# Altium schematic sheet main.SchDoc
size B; SheetNumber: 1; SheetTotal: 1
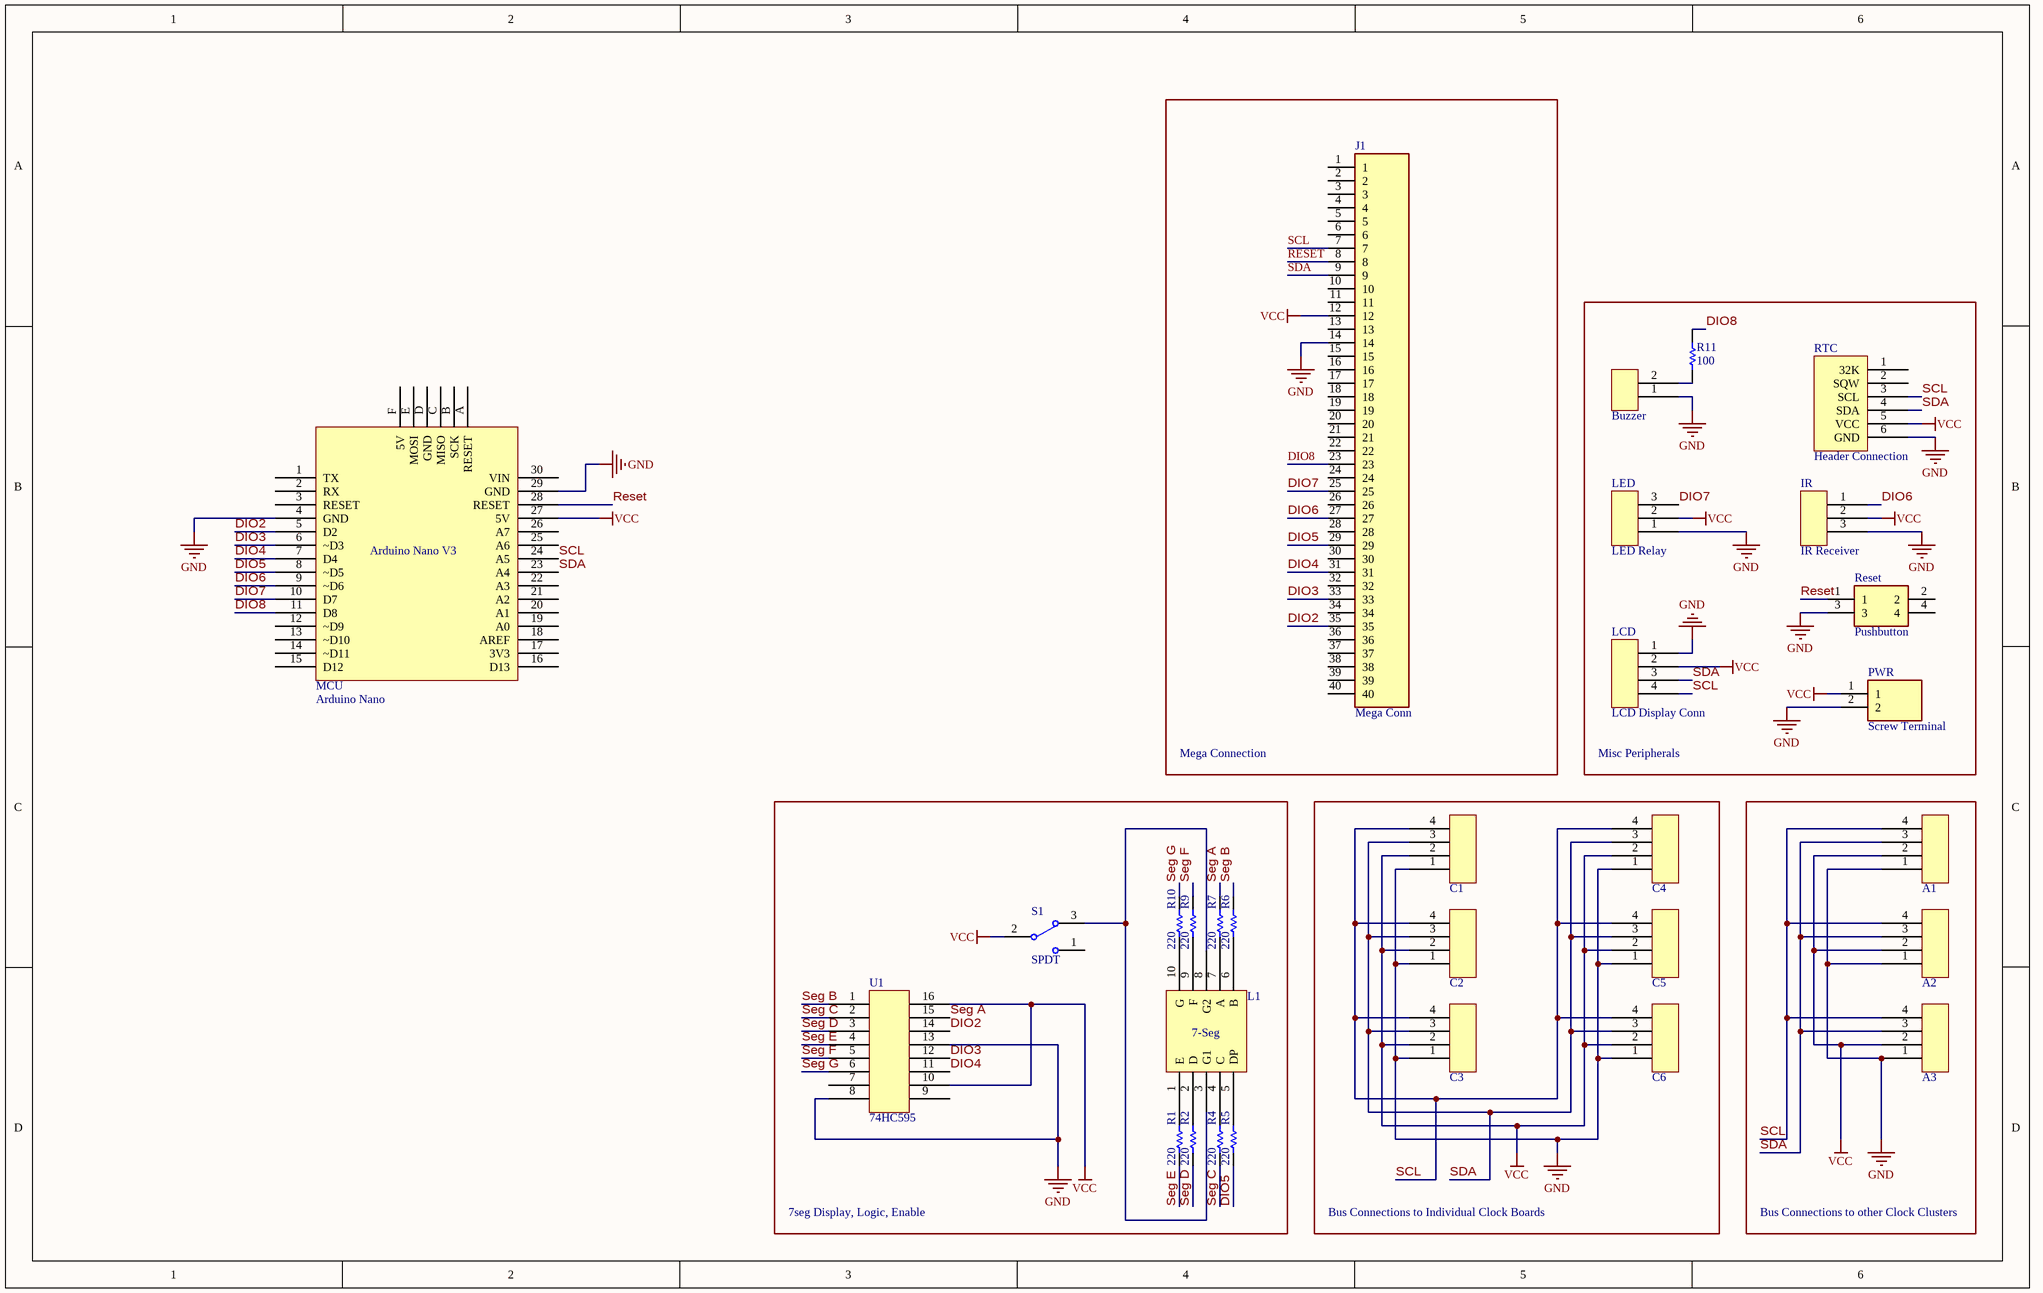
[diagram p0: main.SchDoc]

## Parts
A1  4pin JST 3.96mm  [JST VH 3.96mm 4pin Female Connector]  (value not drawn)
A2  4pin JST 3.96mm  [JST VH 3.96mm 4pin Female Connector]  (value not drawn)
A3  4pin JST 3.96mm  [JST VH 3.96mm 4pin Female Connector]  (value not drawn)
Buzzer  JST Female 2 Pin  [JST FEMALE 2PIN]  (value not drawn)
C1  4pin JST 3.96mm  [JST VH 3.96mm 4pin Female Connector]  (value not drawn)
C2  4pin JST 3.96mm  [JST VH 3.96mm 4pin Female Connector]  (value not drawn)
C3  4pin JST 3.96mm  [JST VH 3.96mm 4pin Female Connector]  (value not drawn)
C4  4pin JST 3.96mm  [JST VH 3.96mm 4pin Female Connector]  (value not drawn)
C5  4pin JST 3.96mm  [JST VH 3.96mm 4pin Female Connector]  (value not drawn)
C6  4pin JST 3.96mm  [JST VH 3.96mm 4pin Female Connector]  (value not drawn)
IR  IR Receiver  [Jst Female 3pin]
J1  Mega Conn  [TE_1-1761681-3]
L1  7seg Display  [7-Seg Display]  (value not drawn)
LCD  LCD Display Conn  [JST Female 4pin]
LED  LED Relay  [Jst Female 3pin]
MCU  Arduino Nano  [Arduino Nano]
PWR  Screw Terminal  [TB00250002BE]
R1  value 220  [AXIAL-0.3]  (hidden comment: Res1)
R2  value 220  [AXIAL-0.3]  (hidden comment: Res1)
R4  value 220  [AXIAL-0.3]  (hidden comment: Res1)
R5  value 220  [AXIAL-0.3]  (hidden comment: Res1)
R6  value 220  [AXIAL-0.3]  (hidden comment: Res1)
R7  value 220  [AXIAL-0.3]  (hidden comment: Res1)
R9  value 220  [AXIAL-0.3]  (hidden comment: Res1)
R10  value 220  [AXIAL-0.3]  (hidden comment: Res1)
R11  value 100  [AXIAL-0.3]  (hidden comment: Res1)
Reset  Pushbutton  [FSM4JH]
RTC  Header Connection  [RTC Module Header Connection]
S1  SPDT  [SPDT Switch]
U1  74HC595  [16pin DIP IC Socket]

## Blocks framed on the sheet
Mega Connection: J1
Misc Peripherals: Buzzer IR LCD LED PWR R11 Reset RTC
7seg Display, Logic, Enable: L1 R1 R2 R4-R7 R9 R10 S1 U1
Bus Connections to Individual Clock Boards: C1-C6
Bus Connections to other Clock Clusters: A1-A3

## Nets
GND: A1.1 A2.1 A3.1 Buzzer.1 C1.1 C2.1 C3.1 C4.1 C5.1 C6.1 IR.3 J1.14 LCD.1 LED.1 MCU.4(GND) MCU.29(GND) PWR.2 Reset.3 RTC.6(GND) U1.8 U1.13
VCC: A1.2 A2.2 A3.2 C1.2 C2.2 C3.2 C4.2 C5.2 C6.2 IR.2 J1.12 LCD.2 LED.2 MCU.27(5V) PWR.1 RTC.5(VCC) S1.2 U1.10 U1.16
DIO2: J1.35 MCU.5(D2) U1.14
DIO3: J1.33 MCU.6(~D3) U1.12
DIO4: J1.31 MCU.7(D4) U1.11
DIO5: J1.29 MCU.8(~D5) R5.2
DIO6: IR.1 J1.27 MCU.9(~D6)
DIO7: J1.25 LED.3 MCU.10(D7)
DIO8: J1.23 MCU.11(D8) R11.1
Reset: J1.8 MCU.28(RESET) Reset.1
SCL: A1.4 A2.4 A3.4 C1.4 C2.4 C3.4 C4.4 C5.4 C6.4 J1.7 LCD.4 MCU.24(A5) RTC.3(SCL)
SDA: A1.3 A2.3 A3.3 C1.3 C2.3 C3.3 C4.3 C5.3 C6.3 J1.9 LCD.3 MCU.23(A4) RTC.4(SDA)
Seg A: R7.1 U1.15
Seg B: R6.1 U1.1
Seg C: R4.2 U1.2
Seg D: R2.2 U1.3
Seg E: R1.2 U1.4
Seg F: R9.1 U1.5
Seg G: R10.1 U1.6
NetBuzzer_2: Buzzer.2 R11.2
NetL1_1: L1.1(E) R1.1
NetL1_2: L1.2(D) R2.1
NetL1_3: L1.3(G1) L1.8(G2) S1.3
NetL1_4: L1.4(C) R4.1
NetL1_5: L1.5(DP) R5.1
NetL1_6: L1.6(B) R6.2
NetL1_7: L1.7(A) R7.2
NetL1_9: L1.9(F) R9.2
NetL1_10: L1.10(G) R10.2

Not connected (* = marked no-connect by the designer): J1 1 2 3 4 5 6 10 11 13 15 16 17 18 19 20 21 22 24 26 28 30 32 34 36 37 38 39 40; MCU 1(TX) 2(RX) 3(RESET) 12(~D9) 13(~D10) 14(~D11) 15(D12) 16(D13) 17(3V3) 18(AREF) 19(A0) 20(A1) 21(A2) 22(A3) 25(A6) 26(A7) 30(VIN) A(RESET) B(SCK) C(MISO) D(GND) E(MOSI) F(5V); Reset 2 4; RTC 1(32K) 2(SQW); S1 1; U1 7 9

## Notes on the sheet
- (in symbol 7seg Display) 7-Seg
- (in symbol Arduino Nano) Arduino Nano V3

## Library data of the parts
A1-A3 C1-C6 = JST VH 3.96mm 4pin Female Connector
IR LED = JST Female 3 Pin
J1 = 1-1761681-3: IDC LOW PRO HDR 50P VERT HT BLACK; Package: None; Price: None; Value: *; MP: 1-1761681-3; Availability: Unavailable
LCD = JST Female 4 Pin
PWR = Screw Terminal: Connector; Manufacturer_Name: CUI Devices; Manufacturer_Part_Number: TB002-500-02BE; Datasheet Link: https://eu.mouser.com/datasheet/2/670/tb002_500-1550579.pdf; Height: 10.4mm; Mouser Part Number: 490-TB002-500-02BE; Mouser Price/Stock: https://www.mouser.co.uk/ProductDetail/CUI-Devices/TB002-500-02BE?qs=vLWxofP3U2x9716kcgva%2Fw%3D%3D; Arrow Part Number: TB002-500-02BE; Arrow Price/Stock: https://www.arrow.com/en/products/tb002-500-02be/cui-devices?region=nac
R1 R2 R4-R7 R9-R11 = Res1: Resistor; Published: 8-Jun-2000; LatestRevisionDate: 17-Jul-2002; LatestRevisionNote: Re-released for DXP Platform.; PackageReference: AXIAL-0.3; Publisher: Altium Limited; PackageDescription: Axial Device, Thru-Hole; 2 Leads; 0.3 in Pin Spacing
Reset = Pushbutton: Switch; Manufacturer_Name: TE Connectivity; Manufacturer_Part_Number: FSM2JAH; Datasheet Link: http://www.te.com/commerce/DocumentDelivery/DDEController?Action=showdoc&DocId=Customer+Drawing%7F1825910%7FC9%7Fpdf%7FEnglish%7FENG_CD_1825910_C9.pdf%7F1825910-3; Mouser Part Number: 506-FSM2JAH; Mouser Price/Stock: https://www.mouser.co.uk/ProductDetail/TE-Connectivity-PB/FSM2JAH?qs=Of7OaoM7rsH02ckr%252BGLHNA%3D%3D
RTC = RTC Module
S1 = SPDT Switch
U1 = 1-2199298-4: Integrated Circuit; Manufacturer_Name: TE Connectivity; Datasheet Link: https://www.te.com/commerce/DocumentDelivery/DDEController?Action=showdoc&DocId=Customer+Drawing%7F2199298%7FA%7Fpdf%7FEnglish%7FENG_CD_2199298_A_baseFilename.pdf%7F1-2199298-4; Height: 5.1mm; Manufacturer_Part_Number: 1-2199298-4; Mouser Part Number: 571-1-2199298-4; Mouser Price/Stock: https://www.mouser.co.uk/ProductDetail/TE-Connectivity/1-2199298-4?qs=fK8dlpkaUMvpL10rY9Abiw%3D%3D; Arrow Part Number: 1-2199298-4; Arrow Price/Stock: https://www.arrow.com/en/products/1-2199298-4/te-connectivity?region=nac